# EAGLE board cn7macropad (EAGLE 9.6.2), part 1 of 3
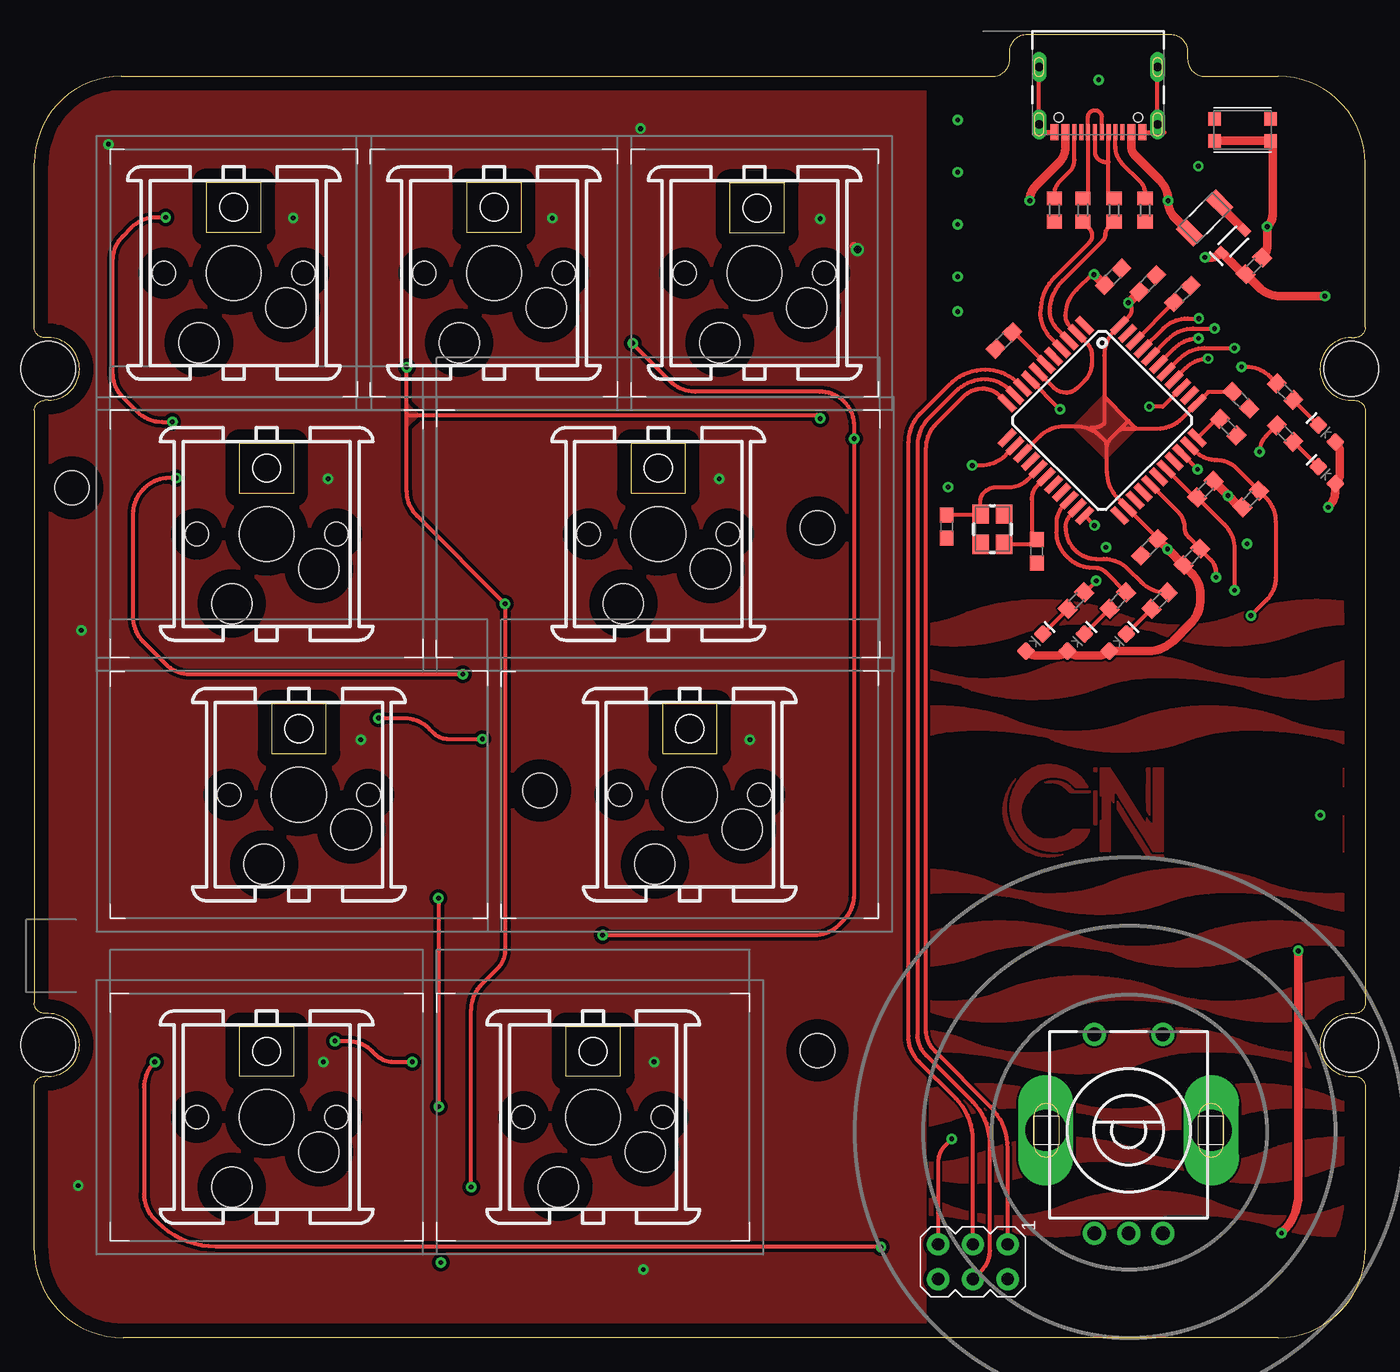
[diagram p3: board, top side]
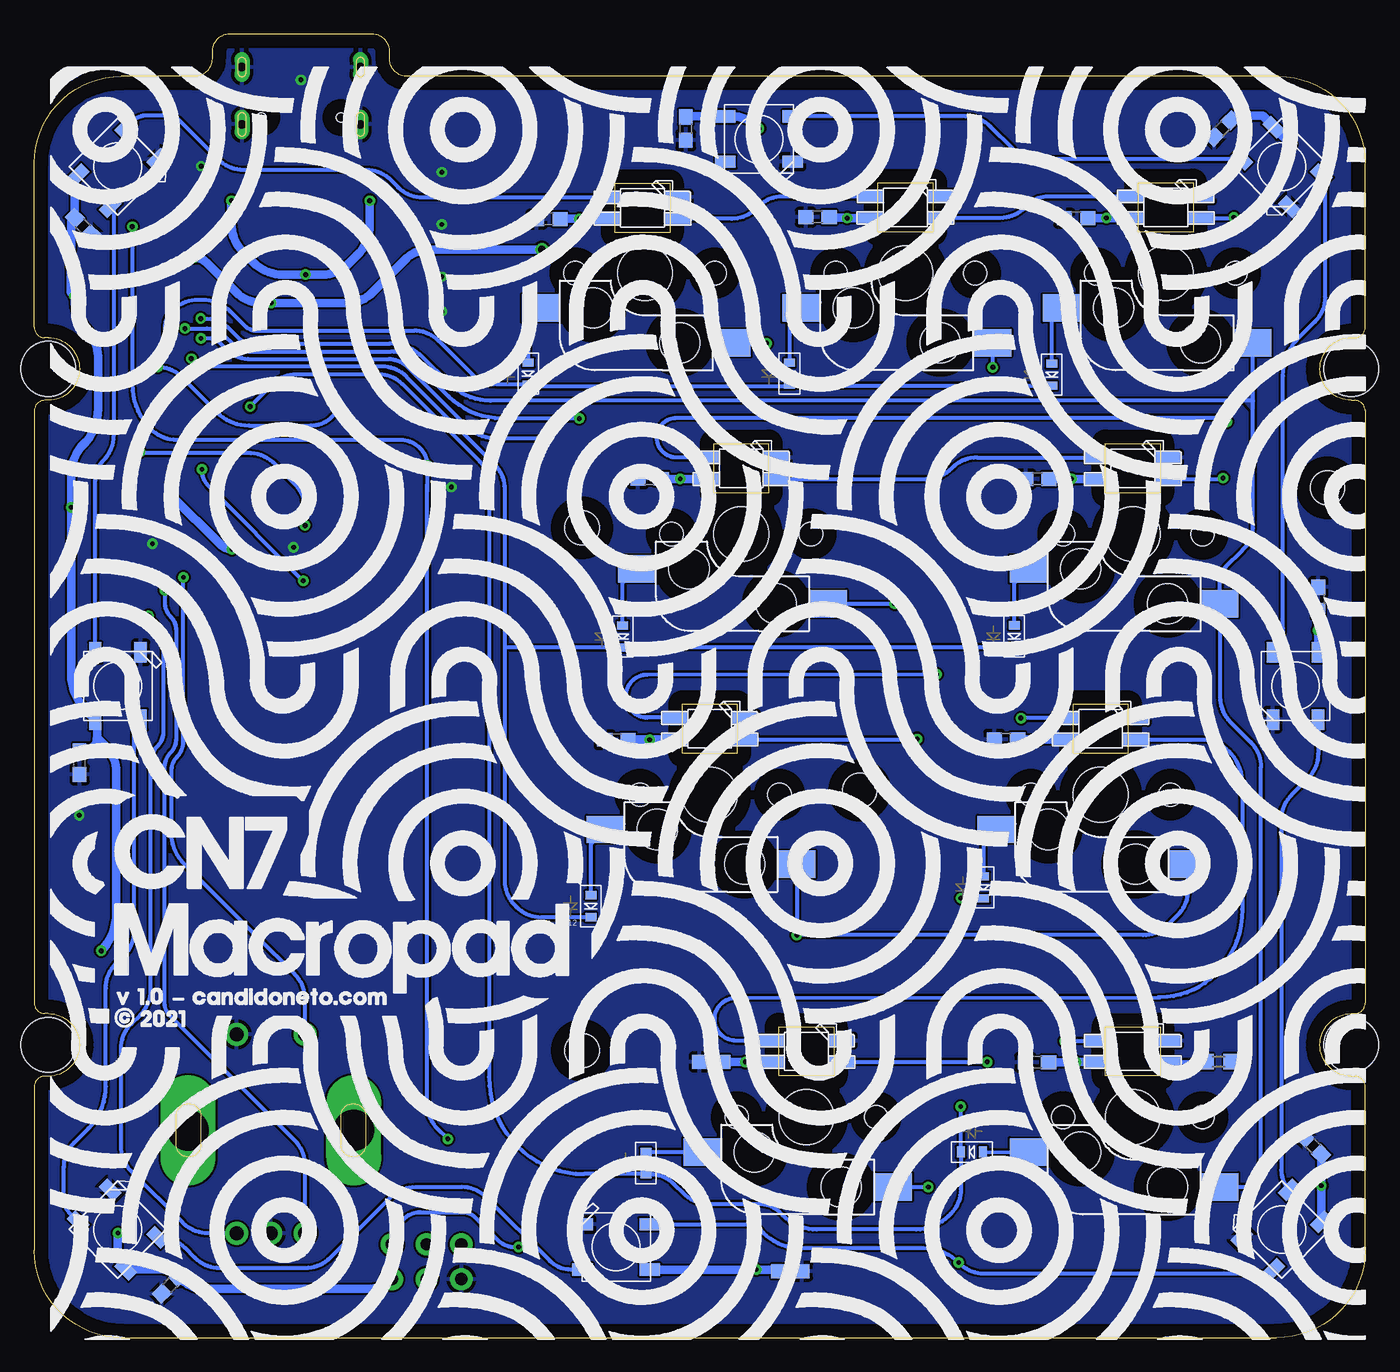
[diagram p4: board, bottom side, seen from below]

Size 97.03 x 95.01 mm. Coordinates in mm from the lower left corner, seen from the top.
Outline: 90.68,0 arc90 97.03,6.35 97.03,18.29 arc90 96.27,19.05 96.01,19.05 arc-90 93.73,21.34 arc-90 96.01,23.62 96.27,23.62 arc90 97.03,24.38 97.03,67.56 arc90 96.27,68.33 96.01,68.33 arc-90 93.73,70.61 arc-90 96.01,72.9 96.27,72.9 arc90 97.03,73.66 97.03,85.6 arc90 90.68,91.95 85.34,91.95 arc-90 84.07,93.22 84.07,93.74 arc90 82.8,95.01 72.39,95.01 arc90 71.12,93.74 71.12,93.22 arc-90 69.85,91.95 6.35,91.95 arc90 0,85.6 0,73.66 arc90 0.76,72.9 1.02,72.9 arc-90 3.3,70.61 arc-90 1.02,68.33 0.76,68.33 arc90 0,67.56 0,24.38 arc90 0.76,23.62 1.02,23.62 arc-90 3.3,21.34 arc-90 1.02,19.05 0.76,19.05 arc90 0,18.29 0,6.35 arc90 6.48,0 90.68,0
Copper layers (1*16): Top 0.035mm / dielectric 1.5mm / Bottom 0.035mm
Design rules "default *": minimum track width 6mil, minimum drill 0.35mm, track to track 6mil, track to pad 6mil, pad to pad 6mil, via to via 6mil, smd to smd 6mil, copper to edge 40mil, drill to drill 6mil, minimum pad ring 10mil, minimum via ring 8mil, stop-mask expansion 4mil, vias tented up to drill 20mil, thermal gap 10mil
Holes 2.5 mm at 36.86,39.88 57.1,59.03 57.1,20.93 2.74,61.95
Holes 4 mm at 1.02,70.61 1.02,21.34 96.01,70.61 96.01,21.34

## Footprints (pad centres in the part's own frame; a part is rotated, then mirrored left to right if it is on the bottom)
0603 = smd 1.1 x 1: 1 -0.85,0; 2 0.85,0
SOD-323 = smd 0.63 x 0.83: A 1.15,0; C -1.15,0
LED-0603 = smd 1 x 1: A -0.877,0; C 0.877,0
SOD-523 = smd 0.8 x 0.6: A 0,-0.8; K 0,0.8
AVRISP = drill 0.9 pad 1.626: 1 -1.27,2.54; 2 1.27,2.54; 3 -1.27,0; 4 1.27,0; 5 -1.27,-2.54; 6 1.27,-2.54
GCT_USB4105_REVA = smd 0.6 x 1.15: A1/B12 -3.2,4.755; A4/B9 -2.4,4.755; B1/A12 3.2,4.755; B4/A9 2.4,4.755 | smd 0.3 x 1.15: A5 -1.25,4.755; A6 -0.25,4.755; A7 0.25,4.755; A8 1.25,4.755; B5 1.75,4.755; B6 0.75,4.755; B7 -0.75,4.755; B8 -1.75,4.755 | drill 0.6 pad 1 long: G1 -4.32,0; G2 4.32,0 | drill 0.6 pad 1.05 long: G3 -4.32,4.18; G4 4.32,4.18 | hole 0.65: 2.89,3.68; -2.89,3.68
SK6812-MINI-E = smd 1.8 x 0.82 bottom: 1-VDD -2.57,0.78; 2-DOUT -2.57,-0.78; 3-GND 2.57,-0.78; 4-DIN 2.57,0.78
WS2812B = smd 1.5 x 0.9: 1-VDD 2.45,-1.65; 2-DOUT 2.45,1.65; 3-GND -2.45,1.65; 4-DIN -2.45,-1.65
R0603 = smd 1 x 1.1: 1 -0.85,0; 2 0.85,0
SW_KMR621NGLFS = smd 0.9 x 1: 1_1 -2.05,0.8; 1_2 2.05,0.8; 2_1 -2.05,-0.8; 2_2 2.05,-0.8
SWITCH_SOCKET-1.25U = smd 2.7 x 2 bottom: 1 6.355,5.08; 2 -7.625,2.54 | hole 4: 0,0 | hole 2.93: -3.81,2.54; 2.54,5.08 | hole 1.7: -5.08,0; 5.08,0
SWITCH_SOCKET-1.5U = smd 2.7 x 2 bottom: 1 6.355,5.08; 2 -7.625,2.54 | hole 4: 0,0 | hole 2.93: -3.81,2.54; 2.54,5.08 | hole 1.7: -5.08,0; 5.08,0
SWITCH_SOCKET-1.75U = smd 2.7 x 2 bottom: 1 6.355,5.08; 2 -7.625,2.54 | hole 4: 0,0 | hole 2.93: -3.81,2.54; 2.54,5.08 | hole 1.7: -5.08,0; 5.08,0
SWITCH_SOCKET-1U = smd 2.7 x 2 bottom: 1 6.355,5.08; 2 -7.625,2.54 | hole 4: 0,0 | hole 2.93: -3.81,2.54; 2.54,5.08 | hole 1.7: -5.08,0; 5.08,0
EC11B-V = drill 1 pad 1.676: A -2.5,-7.5; B 2.5,-7.5; C 0,-7.5; D -2.5,7; E 2.5,7 | drill 3 pad 3.3 long: G1 -6.032,0; G2 6.032,0
TQFP44 = smd 1.5 x 0.5: 1 -5.8,4; 2 -5.8,3.2; 3 -5.8,2.4; 4 -5.8,1.6; 5 -5.8,0.8; 6 -5.8,0; 7 -5.8,-0.8; 8 -5.8,-1.6; 9 -5.8,-2.4; 10 -5.8,-3.2; 11 -5.8,-4; 23 5.8,-4; 24 5.8,-3.2; 25 5.8,-2.4; 26 5.8,-1.6; 27 5.8,-0.8; 28 5.8,0; 29 5.8,0.8; 30 5.8,1.6; 31 5.8,2.4; 32 5.8,3.2; 33 5.8,4 | smd 0.5 x 1.5: 12 -4,-5.8; 13 -3.2,-5.8; 14 -2.4,-5.8; 15 -1.6,-5.8; 16 -0.8,-5.8; 17 0,-5.8; 18 0.8,-5.8; 19 1.6,-5.8; 20 2.4,-5.8; 21 3.2,-5.8; 22 4,-5.8; 34 4,5.8; 35 3.2,5.8; 36 2.4,5.8; 37 1.6,5.8; 38 0.8,5.8; 39 0,5.8; 40 -0.8,5.8; 41 -1.6,5.8; 42 -2.4,5.8; 43 -3.2,5.8; 44 -4,5.8
PTC1206 = smd 1.06 x 1.82: 1 -1.528,0; 2 1.528,0
CRYSTAL-SMD-3.2X2.5MM = smd 1.4 x 1.2: 1 -1.1,-0.85; 2 1.1,-0.85; 3 1.1,0.85; 4 -1.1,0.85

## Placement (x,y rotation side)
C1  10uF  [0603]  87.96,68.33 315 top
C2  1.0uF  [0603]  78.65,77.34 45 top
C3  1.0uF  [0603]  83.7,76.09 45 top
C4  1.0uF  [0603]  70.7,72.69 225 top
C5  1.0uF  [0603]  81.18,76.84 45 top
C6  1.0uF  [0603]  81.29,57.61 225 top
C7  22pF  [0603]  73.09,57.33 90 top
C8  22pF  [0603]  66.52,59.12 90 top
C9  0.1uf  [0603]  93.47,81.03 135 bottom
C10  0.1uf  [0603]  93.73,41.91 90 bottom
C11  0.1uf  [0603]  87.12,3.81 45 bottom
C12  0.1uf  [0603]  3.81,13.97 315 bottom
C13  0.1uf  [0603]  3.43,53.85 270 bottom
C14  0.1uf  [0603]  41.91,4.83 180 bottom
C15  0.1uf  [0603]  10.41,88.14 45 bottom
C16  0.1uf  [0603]  23.93,20.07 0 bottom
C17  0.1uf  [0603]  47.68,20.09 0 bottom
C18  0.1uf  [0603]  26.19,43.61 0 bottom
C19  0.1uf  [0603]  54.58,43.59 0 bottom
C20  0.1uf  [0603]  23.9,62.59 0 bottom
C21  0.1uf  [0603]  52.17,62.61 0 bottom
C22  0.1uf  [0603]  21.08,81.61 0 bottom
C23  0.1uf  [0603]  39.93,81.69 0 bottom
C24  0.1uf  [0603]  59.56,81.53 0 bottom
C25  0.1uf  [0603]  49.53,88.14 90 bottom
D1  3A/10V/280mV  [SOD-323]  87.4,79.91 45 top
D2  [LED-0603]  75.95,50.67 45 top
D3  [LED-0603]  78.99,50.67 45 top
D4  [LED-0603]  94.23,62.86 135 top
D5  [SOD-523]  22.85,70.21 180 bottom
D6  [SOD-523]  25.59,51.13 180 bottom
D7  [SOD-523]  28.68,13.53 90 bottom
D8  [SOD-523]  52.44,12.73 180 bottom
D9  [SOD-523]  54.14,51.1 180 bottom
D10  [SOD-523]  41.97,70.28 180 bottom
D11  [SOD-523]  61.02,70.28 180 bottom
D12  [SOD-523]  56.45,31.45 180 bottom
D13  [SOD-523]  27.83,32.82 180 bottom
D14  [LED-0603]  72.9,50.67 45 top
D15  [LED-0603]  94.23,65.91 135 top
ISP1  AVRISP-6  [AVRISP]  68.43,5.52 270 top
J2  USB4105_REVA  [GCT_USB4105_REVA]  77.57,92.62 180 top
LED_1  [SK6812-MINI-E]  16.94,20.86 180 top
LED_2  [SK6812-MINI-E]  40.74,20.86 180 top
LED_3  [SK6812-MINI-E]  19.29,44.38 180 top
LED_4  [SK6812-MINI-E]  47.79,44.38 180 top
LED_5  [SK6812-MINI-E]  16.94,63.38 180 top
LED_6  [SK6812-MINI-E]  45.49,63.38 180 top
LED_7  [SK6812-MINI-E]  14.54,82.4 180 top
LED_8  [SK6812-MINI-E]  33.51,82.4 180 top
LED_9  [SK6812-MINI-E]  52.7,82.34 180 top
LED_10  WS2812B5050  [WS2812B]  90.93,85.34 225 bottom
LED_11  WS2812B5050  [WS2812B]  90.93,47.5 270 bottom
LED_12  WS2812B5050  [WS2812B]  90.93,7.87 315 bottom
LED_13  WS2812B5050  [WS2812B]  54.61,6.6 0 bottom
LED_14  WS2812B5050  [WS2812B]  6.1,7.87 45 bottom
LED_15  WS2812B5050  [WS2812B]  5.08,47.5 90 bottom
LED_16  WS2812B5050  [WS2812B]  6.1,85.34 135 bottom
LED_17  WS2812B5050  [WS2812B]  44.2,87.38 180 bottom
R1  5.1k  [R0603]  74.37,82.19 270 top
R2  5.1k  [R0603]  80.98,82.19 270 top
R3  22  [R0603]  76.45,82.19 270 top
R4  22  [R0603]  78.72,82.19 270 top
R5  10k  [R0603]  88.92,78.13 45 top
R6  10k  [R0603]  88.68,61.14 225 top
R7  10k  [R0603]  85.38,61.85 45 top
R8  10k  [R0603]  84.39,56.92 225 top
R9  500  [R0603]  10.69,20.12 180 bottom
R10  200  [R0603]  78.99,53.72 225 top
R11  200  [R0603]  82.04,53.72 225 top
R12  200  [R0603]  91.19,65.91 315 top
R13  10k  [R0603]  87.05,66.37 315 top
R14  200  [R0603]  91.19,68.96 315 top
R15  200  [R0603]  75.95,53.72 225 top
S2  KMR621NGLFS  [SW_KMR621NGLFS]  88.09,88.04 0 top
SW1  KAILH1.25U  [SWITCH_SOCKET-1.25U]  16.94,16.06 180 top
SW2  KAILH1.25U  [SWITCH_SOCKET-1.25U]  40.74,16.06 180 top
SW3  KAILH1.5U  [SWITCH_SOCKET-1.5U]  19.29,39.58 180 top
SW4  KAILH1.5U  [SWITCH_SOCKET-1.5U]  47.79,39.58 180 top
SW5  KAILH1.25U  [SWITCH_SOCKET-1.25U]  16.94,58.58 180 top
SW6  KAILH1.75U  [SWITCH_SOCKET-1.75U]  45.49,58.58 180 top
SW7  KAILH  [SWITCH_SOCKET-1U]  14.54,77.6 180 top
SW8  KAILH  [SWITCH_SOCKET-1U]  33.51,77.6 180 top
SW9  KAILH  [SWITCH_SOCKET-1U]  52.51,77.6 180 top
SW10  EC11B-V-T  [EC11B-V]  79.78,15.11 0 top
U1  32U4  [TQFP44]  77.86,66.85 315 top
U$1  PTC-FUSE  [PTC1206]  85.32,81.61 45 top
Y2  [CRYSTAL-SMD-3.2X2.5MM]  69.85,58.93 90 top

## Tracks (layer width: path | path; a pad name or v marks a point on that pad's centre or on a via)
+5V  (via drill 0.35, 0.55)
  Top 0.305: U1.24 79.87,60.49 | 80.28,66.31 79.78,66.82 | 79.78,66.82 78.01,68.59 | C1.1 85.59,68.93 U1.34 83.65,66.99 arc-45 81.85,66.24 79.32,66.24 arc45 79.11,66.15 | 78.12,65.17 78.19,65.23 | 78.19,65.23 78.39,65.43 | 78.39,65.43 79.11,66.15 | 79.11,66.15 79.78,66.82 | 79.78,66.82 | 77.72,65.7 77.08,66.34 77.3,66.34 arc45 77.98,66.62 arc45 78,66.69 78,71.61 arc-45 78.75,73.4 U1.44 | 87.81,60.43 R6.2 | C6.1 81.89,58.29 U1.24 | U1.24 79.02,61.17 arc-45 78.21,63.12 78.21,65 arc-45 78.39,65.43 | U1.14 73.31,65.7 arc-45 75.11,66.45 75.92,66.45 arc-45 77.72,65.7 | 77.72,65.7 78.19,65.23 | U1.44 79.33,73.98 | U1.44 79.45,74.11 | U1.44 79.82,74.48 arc45 80.01,74.93 arc45 79.8,75.44 79.79,75.45
  Top 0.61: C6.1 81.89,58.11 81.99,58.11 v82.62,57.48 83.78,56.32 arc45 R8.2 84.36,55.75 arc-45 85.01,54.18 85.01,53.83 arc-45 84.27,52.04 83.03,50.8 arc-45 81.23,50.05 D3.A arc-45 77.54,49.71 76.16,49.71 arc-45 D2.A arc-45 74.55,49.73 73.05,49.73 arc-45 D14.A | v60.02,79.32 59.77,79.58 | R7.2 87.01,61.42 arc-45 v87.03,61.38 87.72,60.69 arc45 R6.2 | v92.15,28.19 92.15,10.43 arc-45 91.03,7.71 v90.93,7.62 | v94.08,75.92 90.85,75.92 arc-45 89.27,76.58 R5.1 arc-45 88.04,77.64 D1.C arc-45 85.73,78.74 v85.34,78.74 | C5.1 79.79,75.45 arc-45 v79.76,75.44 | v94.34,60.53 arc45 94.85,61.78 D4.A arc45 95.17,63.02 95.17,64.52 arc45 D15.A
  Bottom 0.61: v5.41,87 LED_16.1-VDD 7.48,89.06 9.49,89.06 C15.2 | LED_10.1-VDD 94.09,84.52 C9.2 94.35,81.35 94.37,77.09 94.36,77.09 94.36,76.2 v94.08,75.92 94.08,75.65 arc-45 93.22,73.56 arc45 92.38,71.54 92.38,67.68 arc45 93.45,65.1 arc-45 94.34,62.95 v94.34,60.53 94.34,48.39 arc-45 93.21,45.68 LED_11.1-VDD 92.46,44.92 92.46,43.7 | LED_13.1-VDD v44.4,4.95 42.91,4.95 arc45 42.87,4.94 C14.2 | v3.2,11.07 LED_14.1-VDD | LED_14.1-VDD 3.05,8.59 | 2.94,8.7 LED_14.1-VDD | LED_15.1-VDD v3.43,51.56 C13.2 | 47.01,89.03 LED_17.1-VDD | 93.61,42.67 C10.2 93.38,42.76 arc-45 92.73,43.03 arc-45 92.46,43.7 | LED_9.1-VDD 57.27,81.56 v57.3,81.56 58.69,81.56 C24.2 | LED_7.1-VDD v18.87,81.62 C22.2 | C23.2 39.03,81.64 37.8,81.64 v37.77,81.61 37.76,81.62 LED_8.1-VDD | LED_5.1-VDD 21.4,62.6 | 21.4,62.6 v21.41,62.61 | C20.2 21.41,62.59 21.4,62.6 | LED_6.1-VDD 49.92,62.6 | 49.92,62.6 v49.94,62.61 | C21.2 51.31,62.6 49.92,62.6 | LED_3.1-VDD 23.79,43.6 | 23.79,43.6 v23.8,43.59 | C18.2 25.33,43.6 23.79,43.6 | LED_4.1-VDD 52.16,43.6 v52.17,43.59 C19.2 | LED_1.1-VDD v21.07,20.08 | v21.07,20.08 v21.08,20.09 | C16.2 21.09,20.07 v21.07,20.08 | LED_2.1-VDD v45.18,20.08 | v45.18,20.08 v45.19,20.09 | C17.2 v45.18,20.08 | v60.02,79.32 68.21,79.32 arc-45 70.01,78.58 72.43,76.16 arc45 74.23,75.41 79.69,75.41 arc45 v79.76,75.44 80.48,75.44 arc45 82.28,76.18 | v82.62,57.48 arc45 83.49,57.84 v87.03,61.38 | 71.12,4.1 ISP1.2 arc45 72.65,3.56 84.61,3.56 arc45 86.41,4.3 C11.2 arc-45 87.88,4.98 LED_12.1-VDD | LED_12.1-VDD 90.12,4.73 | LED_12.1-VDD arc45 90.93,6.34 v90.93,7.62 | v44.2,88.14 44.34,88.28 arc-45 46.14,89.03 LED_17.1-VDD | LED_17.1-VDD 49.44,89.03 arc-45 C25.2
  Bottom 0.61: 92.46,43.7 91.8,43.05 arc45 91.06,41.25 91.06,30.85 arc45 92.15,28.21 v92.15,28.19 | LED_14.1-VDD 3.2,13.34 arc-45 C12.2 | v85.34,78.74 arc45 84.48,78.38 82.28,76.18 | 82.25,76.16 82.28,76.18
  pour Top (isolate 0.254, rank 2): -4.2,94.77 -4.2,0.1 64.94,0.1 64.94,94.77
  pour Top: 75.82,66.42 78.11,64.14 80.26,66.29 77.98,68.58
AREF
  Top 0.305: U1.42 C3.1 arc45 C3.1
CC1
  Top 0.305: R2.1 80.98,83.43 arc45 80.64,84.26 79.34,85.56 arc-45 78.82,86.82 78.82,87.86 arc-45 J2.A5
CC2
  Top 0.305: R1.1 74.37,83.35 arc-45 74.76,84.29 75.47,85 arc45 75.83,85.85 J2.B5
COL0  (via drill 0.35)
  Top 0.305: v84.9,74.29 84.07,74.29 arc45 82.3,73.56 U1.41
  Bottom 0.305: 8.19,68.3 63.79,68.3 arc45 66.76,69.53 68.7,71.47 arc-45 71.1,72.47 81.13,72.47 arc45 82.17,72.9 82.81,73.54 arc-45 84.63,74.29 v84.9,74.29 | 8.19,68.3 8.19,59.21 arc45 8.93,57.42 10.19,56.16 arc-45 10.59,55.19 SW5.1 10.59,46.69 arc-45 9.84,44.89 8.34,43.39 arc45 7.59,41.59 7.59,12.07 arc45 7.92,11.28 8.01,11.2 arc45 8.53,10.98 arc-45 8.54,10.98 SW1.1 | 8.19,68.3 SW7.1
  pour Bottom: 8.18,67.69 8.79,68.3 8.18,68.91
COL1  (via drill 0.35)
  Top 0.305: v86.04,73.56 84.48,73.56 arc45 82.69,72.81 U1.40 | v31.85,10.97 31.85,23.94 arc-45 32.6,25.74 33.78,26.92 arc45 34.31,28.21 v34.31,53.49 27.9,59.91 arc-45 27.15,61.71 27.15,67.26 | 27.15,67.26 v27.15,70.74 | 27.15,67.26 57.05,67.26 v57.3,67.01
  Bottom 0.305: SW2.1 31.86,10.98 v31.85,10.97 | v34.31,53.49 39.13,53.49 SW6.1 | v27.15,70.74 SW8.1 | 57.35,67.05 v57.3,67.01 62.93,67.01 arc45 66.81,68.61 69.42,71.23 arc-45 71,71.88 81.17,71.88 arc45 82.61,72.48 83.15,73.02 arc-45 84.45,73.56 v86.04,73.56
  pour Top: 27.15,68.02 27.93,67.25 27.15,66.47
COL2  (via drill 0.35)
  Top 0.305: U1.39 83.12,72.12 arc-45 v84.87,72.85 | v43.64,72.49 arc45 43.67,72.41 46.37,69.7 arc45 48.17,68.96 57.28,68.96 arc-45 59.05,68.22 arc-45 59.78,66.48 v59.78,65.53 59.78,32.26 arc-45 59.03,30.46 58.66,30.08 arc-45 56.86,29.34 v41.43,29.34
  Bottom 0.305: SW4.1 v41.43,29.34 16.19,29.34 arc-45 14.39,30.08 13.68,30.8 arc-45 12.93,32.59 SW3.1 | SW9.1 46.12,72.49 v43.64,72.49 | v84.87,72.85 84.27,72.85 arc45 83.5,72.53 83.04,72.07 arc-45 81.24,71.32 71.21,71.32 arc45 69.8,70.74 65.5,66.44 arc-45 63.31,65.53 v59.78,65.53
D+
  Top 0.305: R3.1 76.72,83.32 76.82,83.34 J2.B6 76.82,88.98 arc-180 77.82,88.98 77.82,88.47 | 77.82,88.47 J2.A6 | 77.82,88.47 77.83,88.47
D-
  Top 0.305: R4.1 78.31,82.89 78.31,85.7 | J2.B7 78.31,87.86 78.31,85.7 | J2.A7 77.32,86.44 arc45 77.52,85.95 arc45 78.13,85.7 78.31,85.7
D_N
  Top 0.305: U1.3 74.57,73.53 arc-45 74.05,74.8 arc-45 74.98,77.07 77.89,79.98 arc45 78.08,80.43 78.08,80.44 arc-45 78.27,80.89 R4.2
D_P
  Top 0.305: 74.85,72.09 U1.4 74.19,72.79 arc-45 73.35,74.8 arc-45 74.4,77.32 76.91,79.83 arc45 77.11,80.32 arc45 76.86,80.93 R3.2
GND  (via drill 0.35)
  Top 0.305: J2.G3 81.89,91.72 | J2.G4 73.25,91.59 | J2.B1/A12 73.43,87.87 arc-45 73.23,88.37 | J2.A1/B12 82.37,87.87 arc45 82.4,87.86
  other vias: 88.42,57.86 67.31,74.8 84.86,85.39 66.62,62 77.6,91.69 93.75,38.07 78.13,57.61 67.31,77.34 67.31,81.15 67.31,84.96 67.31,88.77
  pour Top (rank 4): 65.14,52.07 98.29,52.07 98.29,95.15 65.14,95.15
  pour Bottom (rank 2): -2.93,96.32 -2.93,-1.35 98.92,-1.35 98.92,96.32
  pour Top (rank 4): 65.41,0.13 95.58,0.13 95.58,3.89 66.67,3.56 66.67,4.7 arc90 66.55,4.83 65.41,4.83
GND1
  pour Top (rank 3): 95.44,52 95.47,52 95.44,53.68 95.44,53.68
  pour Top (rank 3): 95.44,46.68 95.47,46.69 95.48,46.69 95.48,49.36 95.47,49.36 95.44,49.35
  pour Top (rank 3): 95.48,43.26 95.48,44.19 95.48,44.2 95.45,44.2 95.44,44.19 95.44,43.28 95.45,43.27
  pour Top (rank 3): 95.44,31.07 95.47,31.07 95.48,31.07 95.48,32.39 95.45,32.39 95.44,32.38
  pour Top (rank 3): 95.44,28.53 95.47,28.52 95.48,28.53 95.48,29.6 95.48,29.61 95.45,29.62 95.44,29.62
  pour Top (rank 3): 95.44,23.91 95.47,23.92 95.48,23.93 95.48,26.31 95.48,26.31 95.44,26.31 95.44,26.3
  pour Top (rank 3): 95.44,19.28 95.47,19.27 95.48,19.28 95.48,20.99 95.47,21 95.44,20.99 95.44,20.98
  pour Top (rank 3): 95.48,16.5 95.48,17.2 95.45,17.21 95.44,17.21 95.44,16.51 95.45,16.5
  pour Top (rank 3): 95.44,14.61 95.44,12.58 95.45,12.58 95.48,12.58 95.48,12.59 95.48,14.61 95.48,14.62 95.44,14.61
  pour Top (rank 3): 95.44,38.06 95.44,35.37 95.44,35.36 95.48,35.37 95.48,35.38 95.48,38.06 95.45,38.06
  pour Top (rank 3): 95.44,40.14 95.47,40.14 95.48,40.14 95.48,41.51 95.45,41.52 95.44,41.51
  pour Top (rank 3): 94.27,52 94.27,51.88 94.28,51.88 94.55,51.92 94.83,51.95 95.09,51.97 95.43,52 95.44,52
  pour Top (rank 3): 76.69,52.03 76.69,53.49 76.69,53.5 76.4,53.55 76.09,53.6 75.75,53.65 75.53,53.67 75.52,53.67 75.52,52.01 75.84,52.02 76.11,52.03 76.39,52.03
  pour Top (rank 3): 94.27,52 95.44,52 95.44,53.67 95.44,53.68 95.15,53.71 94.87,53.73 94.57,53.75 94.27,53.77
  pour Top (rank 3): 93.1,51.65 93.38,51.72 93.66,51.78 93.95,51.83 94.27,51.88 94.27,52 94.26,52 93.1,52 93.1,52
  pour Top (rank 3): 69.66,50.66 69.66,52 69.66,52 68.49,52 68.49,51.99 68.49,50.5 68.56,50.51 68.75,50.53 69.07,50.57 69.37,50.61
  pour Top (rank 3): 83.72,51.93 83.45,51.93 83.16,51.93 82.89,51.94 82.56,51.96 82.55,51.96 82.55,51.1 82.56,51.09 82.69,51.05 82.83,51.01 82.98,50.96 83.14,50.92 83.32,50.87 83.51,50.82 83.72,50.78 83.72,50.78
  pour Top (rank 3): 91.93,52 91.93,51.29 91.93,51.28 92.22,51.39 92.35,51.44 92.5,51.48 92.74,51.56 92.92,51.61 93.09,51.65 93.1,51.66 93.1,52 93.09,52
  pour Top (rank 3): 70.83,50.93 70.83,52 70.83,52 69.67,52 69.66,51.99 69.66,50.66 69.73,50.67 69.93,50.71 70.24,50.78 70.54,50.85
  pour Top (rank 3): 93.1,52 93.1,53.78 92.79,53.77 92.49,53.76 92.18,53.74 91.93,53.72 91.93,52 91.93,52
  pour Top (rank 3): 68.49,52 67.33,52 67.32,52 67.32,50.43 67.59,50.44 67.9,50.45 68.19,50.47 68.49,50.5 68.49,50.51
  pour Top (rank 3): 79.04,52 79.04,52.81 78.7,52.95 78.59,53 78.47,53.04 78.33,53.09 78.18,53.14 78.03,53.19 77.87,53.24 77.86,53.23 77.86,52
  pour Top (rank 3): 77.69,52 77.86,52 77.86,52.01 77.86,53.23 77.86,53.24 77.64,53.3 77.47,53.34 77.31,53.38 76.97,53.45 76.77,53.49 76.7,53.5 76.69,53.5 76.69,52.04 76.7,52.03 76.94,52.03 77.19,52.02 77.44,52.01
  pour Top (rank 3): 94.27,52 94.27,53.77 93.95,53.78 93.65,53.79 93.32,53.79 93.11,53.78 93.1,53.78 93.1,52
  pour Top (rank 3): 74.35,52 74.35,53.76 74.34,53.77 74.17,53.77 73.81,53.78 73.5,53.79 73.18,53.79 73.18,52 73.18,52
  pour Top (rank 3): 73.18,52 73.18,53.78 73.17,53.79 72.96,53.78 72.62,53.77 72.31,53.75 72.01,53.73 72,52 72.01,52
  pour Top (rank 3): 75.45,52 74.35,52 74.35,51.99 74.35,51.9 74.36,51.9 74.63,51.93 74.92,51.96 75.17,51.98
  pour Top (rank 3): 81.38,51.54 81.38,51.99 81.38,52 80.21,52 80.21,52 80.21,51.74 80.21,51.74 80.51,51.69 80.79,51.64 81.09,51.59
  pour Top (rank 3): 69.66,52 69.66,53.37 69.66,53.37 69.35,53.29 69.05,53.21 68.73,53.12 68.53,53.05 68.5,53.04 68.49,53.04 68.49,52 68.5,52
  pour Top (rank 3): 68.49,52 68.49,53.04 68.48,53.04 68.33,52.98 68.04,52.88 67.83,52.8 67.52,52.67 67.32,52.59 67.32,52
  pour Top (rank 3): 74.35,51.9 74.35,52 73.18,52 73.18,51.68 73.49,51.75 73.76,51.8 74.05,51.85
  pour Top (rank 3): 80.21,51.74 80.21,51.99 80.2,52 79.04,52 79.04,52 79.04,51.89 79.34,51.86 79.63,51.82 79.92,51.78
  pour Top (rank 3): 72,52 72,53.73 71.94,53.73 71.73,53.71 71.38,53.67 71.19,53.65 71,53.62 70.84,53.6 70.83,53.59 70.83,52 70.84,52
  pour Top (rank 3): 79.04,51.89 79.04,52 79.03,52 77.86,52 77.86,51.99 78.15,51.97 78.44,51.95 78.74,51.92
  pour Top (rank 3): 75.45,52 75.51,52 75.52,52.01 75.52,53.67 75.23,53.7 74.95,53.73 74.65,53.75 74.35,53.77 74.35,53.76 74.35,52.01 74.35,52
  pour Top (rank 3): 71.97,51.31 72,51.32 72,51.33 72,52 72,52 70.83,52 70.83,50.94 70.84,50.93 71.12,51.02 71.41,51.11 71.69,51.2
  pour Top (rank 3): 73.18,51.68 73.18,52 73.17,52 72.01,52 72,51.99 72.01,51.32 72.15,51.37 72.29,51.42 72.43,51.47 72.57,51.52 72.71,51.56 72.87,51.6 73.02,51.64
  pour Top (rank 3): 77.86,52 77.69,52 77.86,51.99
  pour Top (rank 3): 66.15,52 64.98,52 64.97,52 64.97,50.56 64.98,50.56 65.18,50.53 65.37,50.51 65.56,50.49 65.77,50.48 65.96,50.46 66.14,50.45 66.15,50.45
  pour Top (rank 3): 67.32,52.59 67.18,52.54 67.04,52.49 66.89,52.44 66.74,52.39 66.6,52.35 66.45,52.31 66.31,52.27 66.15,52.23 66.15,52.23 66.15,52.01 66.15,52 67.32,52
  pour Top (rank 3): 70.83,52 70.83,53.59 70.83,53.6 70.53,53.55 70.24,53.5 69.95,53.44 69.67,53.37 69.66,53.37 69.66,52 69.67,52
  pour Top (rank 3): 81.38,52 81.38,52.13 81.37,52.13 81.04,52.2 80.77,52.26 80.48,52.33 80.21,52.41 80.21,52 80.22,52
  pour Top (rank 3): 67.32,50.43 67.32,52 67.31,52 66.15,52 66.15,50.45 66.15,50.45 66.38,50.44 66.71,50.43 67.02,50.43
  pour Top (rank 3): 66.15,52.23 65.86,52.17 65.57,52.11 65.28,52.06 64.98,52.02 64.97,52.02 64.97,52.01 64.98,52 66.14,52 66.15,52.01
  pour Top (rank 3): 80.21,52 80.21,52.41 79.9,52.5 79.75,52.55 79.6,52.6 79.32,52.7 79.18,52.75 79.04,52.81 79.04,52.8 79.04,52 79.04,52
  pour Top (rank 3): 83.72,50.77 84.05,50.71 84.37,50.65 84.58,50.62 84.79,50.58 84.89,50.57 84.9,50.58 84.9,52 84.89,52 84.8,52 84.54,51.98 84.26,51.95 84,51.94 83.73,51.93 83.72,51.93
  pour Top (rank 3): 88.41,52 88.41,53 88.2,52.93 88,52.85 87.83,52.79 87.55,52.67 87.4,52.61 87.25,52.55 87.24,52.55 87.24,52 87.25,52
  pour Top (rank 3): 90.75,50.9 90.75,52 89.58,52 89.58,50.65 89.59,50.64 89.77,50.68 89.95,50.71 90.13,50.75 90.44,50.82
  pour Top (rank 3): 89.58,52 89.58,53.34 89.58,53.35 89.36,53.29 89.18,53.24 89.01,53.19 88.69,53.1 88.53,53.04 88.41,53 88.41,52
  pour Top (rank 3): 89.58,50.64 89.58,52 89.58,52 88.41,52 88.41,51.99 88.41,50.49 88.48,50.5 88.67,50.52 88.99,50.55 89.29,50.6
  pour Top (rank 3): 86.07,52 84.9,52 84.9,52 84.9,50.57 85.19,50.53 85.48,50.5 85.77,50.48 86.06,50.46 86.07,50.46
  pour Top (rank 3): 84.9,52.01 84.81,52 84.89,52
  pour Top (rank 3): 91.93,51.28 91.93,52 91.92,52 90.76,52 90.75,51.99 90.75,50.91 90.76,50.9 90.95,50.96 91.12,51.01 91.3,51.06 91.46,51.12 91.62,51.17 91.77,51.22
  pour Top (rank 3): 87.24,50.43 87.24,52 87.23,52 86.07,52 86.07,51.99 86.07,50.46 86.33,50.44 86.64,50.43 86.94,50.43
  pour Top (rank 3): 86.07,52 86.07,52.2 86.06,52.21 85.82,52.16 85.57,52.11 85.4,52.08 85.23,52.05 85.07,52.03 84.9,52.01 84.9,52
  pour Top (rank 3): 87.24,52 87.24,52.55 87.23,52.55 86.96,52.45 86.82,52.41 86.67,52.37 86.41,52.29 86.24,52.25 86.08,52.21 86.07,52.21 86.07,52 86.07,52
  pour Top (rank 3): 88.41,50.49 88.41,51.99 88.41,52 87.25,52 87.24,52 87.24,50.43 87.53,50.44 87.83,50.45 88.11,50.47
  pour Top (rank 3): 81.38,51.54 81.64,51.48 81.65,51.48 81.77,51.43 81.88,51.39 81.97,51.34 82.12,51.27 82.23,51.22 82.41,51.15 82.54,51.1 82.55,51.1 82.55,51.95 82.55,51.96 82.5,51.96 82.45,51.97 82.16,52 81.38,52 81.38,52
  pour Top (rank 3): 91.93,52 91.93,53.72 91.92,53.72 91.8,53.71 91.6,53.69 91.4,53.67 91.08,53.63 90.76,53.58 90.75,52 90.76,52
  pour Top (rank 3): 82.17,52 81.98,52.03 81.79,52.06 81.6,52.09 81.38,52.13 81.38,52
  pour Top (rank 3): 90.75,52 90.75,53.58 90.47,53.53 90.17,53.48 89.87,53.41 89.58,53.35 89.58,52 89.59,52
  pour Top (rank 3): 77.78,47.4 77.86,47.43 77.86,48.43 77.85,48.43 76.69,48.43 76.69,47.04 76.97,47.12 77.24,47.21 77.51,47.3
  pour Top (rank 3): 80.21,48 80.21,48.42 80.2,48.43 79.04,48.43 79.04,48.42 79.04,47.79 79.04,47.79 79.34,47.85 79.65,47.91 79.92,47.96
  pour Top (rank 3): 79.04,47.79 79.04,48.43 79.03,48.43 77.86,48.43 77.86,47.44 77.87,47.44 78.02,47.49 78.18,47.55 78.45,47.63 78.59,47.67 78.74,47.71 78.88,47.75
  pour Top (rank 3): 66.15,48.46 66.15,48.43 66.15,48.43 66.27,48.43
  pour Top (rank 3): 82.55,48.13 82.55,48.43 82.54,48.43 81.39,48.43 81.38,48.43 81.38,48.11 81.39,48.1 81.68,48.12 81.96,48.12 82.25,48.13
  pour Top (rank 3): 76.69,47.04 76.69,48.43 76.68,48.43 75.52,48.43 75.52,48.42 75.52,46.77 75.61,46.78 75.79,46.82 76.1,46.89 76.39,46.96
  pour Top (rank 3): 95.16,46.64 94.27,46.64 94.27,46.63 94.27,46.56 94.28,46.56 94.35,46.56 94.67,46.59 94.92,46.61
  pour Top (rank 3): 88.41,47.33 88.53,47.29 88.66,47.24 88.8,47.18 88.95,47.13 89.12,47.08 89.31,47.03 89.58,46.96 89.58,46.96 89.58,48.03 89.29,48.03 89.01,48.04 88.71,48.06 88.41,48.08
  pour Top (rank 3): 86.07,47.83 86.07,48.42 86.06,48.43 84.9,48.43 84.9,48.42 84.9,47.98 84.9,47.98 85.25,47.94 85.51,47.91 85.79,47.87
  pour Top (rank 3): 81.38,48.1 81.38,48.42 81.37,48.43 80.21,48.43 80.21,48.42 80.21,48 80.21,48 80.5,48.03 80.78,48.06 81.08,48.09
  pour Top (rank 3): 84.9,47.98 84.9,48.42 84.89,48.43 83.73,48.43 83.72,48.42 83.72,48.09 83.73,48.08 84.01,48.06 84.3,48.04 84.6,48.01
  pour Top (rank 3): 73.18,46.53 73.18,46.63 73.17,46.64 72.01,46.64 72,46.64 72.01,46.54 72.29,46.53 72.59,46.53 72.88,46.52
  pour Top (rank 3): 70.83,48.12 70.55,48.09 70.26,48.07 69.96,48.05 69.66,48.03 69.66,48.02 69.66,46.84 69.76,46.82 69.95,46.78 70.3,46.72 70.52,46.69 70.73,46.66 70.83,46.65 70.83,46.65
  pour Top (rank 3): 80.21,48.43 80.21,49.86 79.94,49.87 79.62,49.88 79.31,49.88 79.04,49.88 79.04,48.43 79.04,48.43
  pour Top (rank 3): 72,46.64 72,48.34 71.71,48.27 71.45,48.22 71.19,48.18 71.01,48.15 70.84,48.13 70.83,48.12 70.83,46.65 70.84,46.65 70.88,46.64
  pour Top (rank 3): 74.35,46.6 74.35,46.64 73.18,46.64 73.18,46.54 73.18,46.53 73.41,46.53 73.66,46.55 74.01,46.57
  pour Top (rank 3): 84.9,48.43 84.9,48.89 84.89,48.89 84.75,48.95 84.53,49.04 84.42,49.09 84.3,49.14 84.14,49.19 83.95,49.25 83.73,49.32 83.72,49.31 83.72,48.43
  pour Top (rank 3): 74.72,46.64 74.35,46.64 74.35,46.64 74.35,46.6 74.35,46.6 74.38,46.6
  pour Top (rank 3): 66.15,48.43 64.98,48.43 64.97,48.43 64.97,47.98 64.98,47.97 65.27,47.93 65.56,47.9 65.85,47.86 66.14,47.81 66.15,47.82
  pour Top (rank 3): 86.07,48.43 86.07,48.48 86.07,48.49 85.76,48.58 85.46,48.68 85.18,48.78 84.9,48.89 84.9,48.43 84.9,48.43
  pour Top (rank 3): 74.72,46.64 74.97,46.67 75.21,46.71 75.51,46.77 75.52,46.77 75.52,48.42 75.51,48.43 74.35,48.43 74.35,48.42 74.35,46.65 74.35,46.64
  pour Top (rank 3): 66.15,48.46 65.85,48.55 65.56,48.64 65.31,48.72 65.14,48.78 64.98,48.84 64.97,48.84 64.97,48.43 66.14,48.43 66.15,48.43
  pour Top (rank 3): 74.35,48.43 73.18,48.43 73.18,46.65 73.18,46.64 74.34,46.64 74.35,46.65
  pour Top (rank 3): 72,46.64 73.17,46.64 73.18,46.64 73.18,48.43 73.17,48.43 72.34,48.43 72.19,48.39 72,48.34
  pour Top (rank 3): 79.04,48.43 79.04,49.88 79.03,49.88 78.91,49.88 78.71,49.88 78.51,49.87 78.19,49.85 77.87,49.83 77.86,49.83 77.86,48.43
  pour Top (rank 3): 86.3,48.43 86.07,48.49 86.07,48.48 86.07,48.43 86.07,48.43
  pour Top (rank 3): 86.07,47.83 86.36,47.78 86.65,47.73 86.94,47.68 87.23,47.62 87.24,47.63 87.24,48.23 87.02,48.27 86.83,48.3 86.57,48.36 86.3,48.43 86.08,48.43 86.07,48.43
  pour Top (rank 3): 83.72,48.08 83.72,48.43 83.72,48.43 82.55,48.43 82.55,48.13 82.56,48.13 82.9,48.12 83.16,48.11 83.44,48.1
  pour Top (rank 3): 75.52,48.43 75.52,49.47 75.51,49.48 75.32,49.43 75.12,49.38 74.93,49.33 74.73,49.27 74.55,49.21 74.35,49.15 74.35,49.14 74.35,48.43 74.36,48.43
  pour Top (rank 3): 90.75,46.72 91.03,46.68 91.31,46.64 91.92,46.64 91.93,46.65 91.93,48.23 91.92,48.23 91.62,48.17 91.31,48.13 91.03,48.1 90.76,48.07 90.75,48.06
  pour Top (rank 3): 93.1,48.52 93.1,48.44 93.1,48.43 94.27,48.43 94.27,48.96 94.26,48.96 94.15,48.92 93.79,48.77 93.58,48.69 93.34,48.6
  pour Top (rank 3): 67.32,48.2 67.04,48.25 66.78,48.31 66.53,48.36 66.27,48.43 66.15,48.43 66.15,47.82 66.15,47.81 66.44,47.76 66.74,47.71 67.02,47.66 67.31,47.6 67.32,47.61
  pour Top (rank 3): 93.1,46.64 94.27,46.64 94.27,48.42 94.26,48.43 93.1,48.43 93.1,48.42
  pour Top (rank 3): 91.93,48.23 91.93,46.65 91.93,46.64 93.09,46.64 93.1,46.65 93.1,48.43 92.78,48.43 92.56,48.37 92.35,48.32 92.14,48.27
  pour Top (rank 3): 93.1,48.43 93.1,48.52 92.93,48.47 92.78,48.43
  pour Top (rank 3): 91.93,46.58 91.93,46.63 91.93,46.64 91.32,46.64 91.61,46.61
  pour Top (rank 3): 77.86,48.43 77.86,49.83 77.86,49.83 77.75,49.82 77.54,49.8 77.34,49.78 77.01,49.74 76.69,49.7 76.69,48.43 76.7,48.43
  pour Top (rank 3): 76.69,48.43 76.69,49.7 76.68,49.7 76.64,49.69 76.43,49.66 76.1,49.6 75.78,49.54 75.58,49.49 75.53,49.48 75.52,49.48 75.52,48.43 75.53,48.43
  pour Top (rank 3): 94.27,48.43 95.43,48.43 95.44,48.43 95.44,49.35 95.33,49.32 95.16,49.27 94.85,49.17 94.56,49.07 94.28,48.97 94.27,48.96
  pour Top (rank 3): 94.27,48.43 94.27,46.65 94.28,46.64 95.15,46.64 95.25,46.65 95.44,46.68 95.44,46.69 95.44,48.43 95.43,48.43
  pour Top (rank 3): 89.58,48.03 89.58,46.96 89.59,46.95 89.79,46.91 90.12,46.83 90.43,46.77 90.75,46.72 90.75,46.73 90.75,48.07 90.47,48.05 90.18,48.03 89.88,48.03
  pour Top (rank 3): 81.38,48.43 81.38,49.76 81.11,49.79 80.81,49.82 80.51,49.84 80.21,49.86 80.21,49.85 80.21,48.43 80.22,48.43
  pour Top (rank 3): 67.83,47.4 67.9,47.37 67.96,47.34 68.13,47.27 68.24,47.23 68.35,47.19 68.48,47.14 68.49,47.15 68.49,48.04 68.48,48.05 68.28,48.06 67.96,48.1 67.65,48.14 67.32,48.2 67.32,48.19 67.32,47.61 67.32,47.6 67.43,47.58 67.49,47.56 67.58,47.52 67.67,47.48 67.75,47.44
  pour Top (rank 3): 91.93,46.58 92.21,46.56 92.51,46.54 92.8,46.53 93.1,46.52 93.1,46.53 93.1,46.64 93.09,46.64 91.93,46.64 91.93,46.63
  pour Top (rank 3): 70.88,46.64 71.22,46.6 71.57,46.57 71.78,46.56 72,46.54 72,46.55 72,46.64 72,46.64
  pour Top (rank 3): 93.1,46.52 93.4,46.52 93.69,46.53 93.98,46.54 94.27,46.56 94.27,46.64 93.1,46.64
  pour Top (rank 3): 82.55,48.43 82.55,49.58 82.55,49.59 82.27,49.64 81.97,49.69 81.67,49.73 81.38,49.76 81.38,48.43 81.39,48.43
  pour Top (rank 3): 88.41,47.33 88.41,48.08 88.13,48.11 87.86,48.14 87.55,48.18 87.25,48.23 87.24,48.23 87.24,47.63 87.24,47.62 87.52,47.57 87.78,47.51 88.03,47.46 88.28,47.4
  pour Top (rank 3): 73.18,48.43 73.18,48.69 73.17,48.7 72.97,48.63 72.77,48.56 72.57,48.49 72.35,48.43
  pour Top (rank 3): 74.35,48.43 74.35,49.14 74.35,49.15 74.06,49.05 73.79,48.95 73.63,48.88 73.35,48.77 73.18,48.7 73.18,48.7 73.18,48.43
  pour Top (rank 3): 83.72,48.43 83.72,49.31 83.72,49.32 83.45,49.39 83.16,49.46 82.87,49.53 82.55,49.59 82.55,49.58 82.55,48.43 82.56,48.43
  pour Top (rank 3): 69.66,48.03 69.37,48.03 69.08,48.03 68.81,48.03 68.49,48.04 68.49,47.15 68.49,47.14 68.76,47.06 69.05,46.98 69.35,46.91 69.66,46.84 69.66,46.85
  pour Top (rank 3): 86.07,44.86 87.23,44.86 87.24,44.86 87.24,45.98 87.2,45.98 87,46 86.68,46.02 86.37,46.03 86.07,46.04
  pour Top (rank 3): 91.84,44.86 91.63,44.93 91.43,45.01 91.23,45.09 90.93,45.22 90.76,45.28 90.75,45.28 90.75,44.86
  pour Top (rank 3): 75.52,44.19 75.33,44.19 75.13,44.2 74.93,44.2 74.73,44.22 74.56,44.23 74.35,44.26 74.35,44.26 74.35,43.52 74.46,43.47 74.58,43.42 74.72,43.37 74.87,43.32 75.02,43.27 75.18,43.22 75.37,43.17 75.52,43.13
  pour Top (rank 3): 89.58,44.86 90.75,44.86 90.75,45.28 90.75,45.29 90.71,45.3 90.53,45.37 90.37,45.41 90.21,45.46 90.05,45.51 89.86,45.56 89.61,45.62 89.59,45.62 89.58,45.62
  pour Top (rank 3): 75.77,43.07 76.69,43.07 76.69,43.08 76.69,44.22 76.69,44.23 76.42,44.21 76.16,44.19 75.85,44.19 75.53,44.19 75.52,44.18 75.52,43.14 75.52,43.13
  pour Top (rank 3): 77.86,43.07 77.86,44.37 77.86,44.38 77.59,44.33 77.32,44.29 77.02,44.26 76.7,44.23 76.69,44.22 76.69,43.07 76.7,43.07
  pour Top (rank 3): 91.93,44.07 92.22,44.03 92.51,43.99 92.79,43.94 93.1,43.89 93.1,44.5 92.78,44.58 92.49,44.65 92.2,44.74 91.93,44.83 91.93,44.82
  pour Top (rank 3): 89.58,44.27 89.87,44.26 90.16,44.24 90.46,44.22 90.75,44.2 90.75,44.85 90.75,44.86 89.59,44.86 89.58,44.85
  pour Top (rank 3): 86.07,44.07 86.34,44.11 86.64,44.16 86.92,44.19 87.24,44.22 87.24,44.85 87.23,44.86 86.07,44.86 86.07,44.85
  pour Top (rank 3): 79.04,43.07 80.21,43.07 80.21,44.85 80.2,44.86 79.59,44.86 79.31,44.75 79.04,44.67 79.04,44.66
  pour Top (rank 3): 80.21,45.1 80.03,45.03 79.77,44.93 79.59,44.86 80.2,44.86 80.21,44.86
  pour Top (rank 3): 84.22,43.56 84.38,43.62 84.55,43.68 84.72,43.74 84.89,43.79 84.9,43.8 84.9,44.85 84.89,44.86 83.73,44.86 83.72,44.85 83.72,43.39 83.98,43.47
  pour Top (rank 3): 90.75,44.86 90.75,44.2 90.76,44.2 91.04,44.17 91.32,44.14 91.59,44.11 91.93,44.07 91.93,44.82 91.92,44.83 91.84,44.85 91.83,44.86
  pour Top (rank 3): 79.04,44.66 78.89,44.62 78.75,44.58 78.46,44.51 78.17,44.44 78.01,44.41 77.86,44.38 77.86,43.08 77.87,43.07 79.03,43.07 79.04,43.07
  pour Top (rank 3): 68.49,45.83 68.17,45.87 67.84,45.92 67.64,45.94 67.43,45.96 67.32,45.97 67.32,45.97 67.32,44.86 68.48,44.86 68.49,44.86
  pour Top (rank 3): 77.86,42.74 77.86,43.06 77.86,43.07 76.7,43.07 76.69,43.06 76.69,42.89 76.7,42.89 76.98,42.84 77.28,42.81 77.58,42.77
  pour Top (rank 3): 94.27,43.66 94.5,43.61 94.71,43.56 94.85,43.49 94.94,43.45 95.03,43.42 95.24,43.34 95.37,43.3 95.44,43.28 95.44,44.19 95.44,44.2 95.12,44.22 94.8,44.24 94.53,44.27 94.28,44.3 94.27,44.3
  pour Top (rank 3): 76.69,43.07 75.78,43.07 75.98,43.02 76.22,42.97 76.45,42.93 76.69,42.89 76.69,42.9
  pour Top (rank 3): 68.49,44.86 67.32,44.85 67.32,44.24 67.32,44.23 67.64,44.25 67.97,44.27 68.23,44.28 68.48,44.29 68.49,44.29
  pour Top (rank 3): 69.66,45.6 69.38,45.67 69.09,45.72 68.77,45.78 68.49,45.83 68.49,44.86 68.5,44.86 69.66,44.86
  pour Top (rank 3): 87.24,44.22 87.53,44.25 87.81,44.26 88.1,44.28 88.41,44.29 88.41,44.29 88.41,44.85 88.41,44.86 87.25,44.86 87.24,44.85
  pour Top (rank 3): 93.1,44.5 93.1,43.89 93.45,43.82 93.72,43.77 93.99,43.72 94.27,43.66 94.27,43.67 94.27,44.3 94.26,44.3 93.94,44.35 93.61,44.4 93.27,44.46
  pour Top (rank 3): 79.04,42.68 79.04,43.07 77.87,43.07 77.86,43.07 77.86,42.75 77.92,42.74 78.12,42.72 78.44,42.7 78.74,42.69
  pour Top (rank 3): 87.24,44.86 88.41,44.86 88.41,45.84 88.41,45.84 88.08,45.89 87.75,45.93 87.54,45.95 87.32,45.97 87.24,45.98 87.24,45.97
  pour Top (rank 3): 71.05,45.16 70.89,45.22 70.84,45.24 70.83,45.24 70.83,44.86 70.84,44.86 71.81,44.86 71.81,44.86 71.6,44.93 71.4,45.01 71.22,45.08
  pour Top (rank 3): 72,44.79 71.81,44.86 70.84,44.86 70.83,44.85 70.83,44.19 70.84,44.19 71.17,44.16 71.49,44.12 72,44.06
  pour Top (rank 3): 82.55,44.86 82.55,45.76 82.54,45.76 82.35,45.72 82.17,45.69 81.99,45.65 81.69,45.58 81.38,45.49 81.38,45.48 81.38,44.86
  pour Top (rank 3): 81.38,44.86 81.38,45.48 81.38,45.49 81.06,45.4 80.76,45.3 80.59,45.25 80.43,45.19 80.23,45.11 80.22,45.11 80.21,45.1 80.21,44.86
  pour Top (rank 3): 82.62,43.07 82.9,43.14 83.18,43.22 83.45,43.3 83.72,43.38 83.72,43.39 83.72,44.86 82.56,44.86 82.55,44.85 82.55,43.07 82.56,43.07
  pour Top (rank 3): 81.38,43.07 82.55,43.07 82.55,44.85 82.55,44.86 81.38,44.86 81.38,44.85
  pour Top (rank 3): 81.38,44.86 80.21,44.85 80.21,43.07 80.21,43.07 81.37,43.07 81.38,43.08
  pour Top (rank 3): 69.66,44.27 69.66,44.86 68.5,44.86 68.49,44.85 68.49,44.29 68.5,44.29 68.84,44.29 69.1,44.29 69.37,44.28
  pour Top (rank 3): 74.26,43.56 74.35,43.52 74.35,43.53 74.35,44.26 74.34,44.26 74.05,44.31 73.75,44.36 73.46,44.41 73.18,44.47 73.18,44.47 73.18,43.88 73.18,43.87 73.54,43.8 73.86,43.74 73.95,43.71 74.07,43.66 74.17,43.61
  pour Top (rank 3): 80.21,42.71 80.21,43.06 80.2,43.07 79.04,43.07 79.04,43.06 79.04,42.69 79.04,42.68 79.27,42.68 79.6,42.69 79.91,42.7
  pour Top (rank 3): 88.41,44.86 89.58,44.86 89.58,45.62 89.57,45.63 89.39,45.67 89.05,45.74 88.74,45.79 88.41,45.84 88.41,45.84
  pour Top (rank 3): 82.55,44.86 83.72,44.86 83.72,45.93 83.72,45.94 83.61,45.92 83.39,45.9 83.17,45.87 82.98,45.84 82.79,45.81 82.56,45.77 82.55,45.76
  pour Top (rank 3): 67.32,44.86 66.15,44.86 66.15,44.85 66.15,44.1 66.15,44.09 66.43,44.13 66.72,44.17 67,44.2 67.31,44.23 67.32,44.24
  pour Top (rank 3): 88.41,44.29 88.69,44.29 88.99,44.29 89.27,44.28 89.58,44.27 89.58,44.85 89.58,44.86 88.42,44.86 88.41,44.85
  pour Top (rank 3): 70.83,44.86 69.67,44.86 69.66,44.85 69.66,44.28 69.66,44.27 69.95,44.25 70.24,44.24 70.54,44.21 70.83,44.19 70.83,44.19
  pour Top (rank 3): 66.15,46.04 65.85,46.04 65.55,46.04 65.25,46.04 64.97,46.03 64.97,44.86 64.98,44.86 66.14,44.86 66.15,44.86
  pour Top (rank 3): 73.18,44.47 72.88,44.54 72.58,44.62 72.29,44.7 72,44.79 72,44.06 72.35,44.01 72.61,43.97 72.9,43.92 73.17,43.87 73.18,43.88
  pour Top (rank 3): 66.15,44.86 64.98,44.86 64.97,44.85 64.97,43.83 64.98,43.83 65.12,43.87 65.28,43.91 65.57,43.98 65.84,44.03 66.15,44.09
  pour Top (rank 3): 70.83,45.25 70.7,45.3 70.57,45.34 70.43,45.39 70.28,45.44 70.11,45.48 69.94,45.53 69.7,45.59 69.67,45.6 69.66,45.6 69.66,44.86 69.66,44.86 70.83,44.86 70.83,44.86
  pour Top (rank 3): 67.32,45.97 67.03,45.99 66.73,46.01 66.44,46.03 66.15,46.04 66.15,44.86 66.15,44.86 67.31,44.86 67.32,44.86
  pour Top (rank 3): 82.55,43.05 82.55,43.06 82.55,43.07 81.39,43.07 81.38,43.07 81.38,42.83 81.67,42.88 81.97,42.93 82.26,42.99
  pour Top (rank 3): 84.9,44.86 84.9,46.02 84.89,46.03 84.58,46.01 84.27,45.99 83.94,45.96 83.73,45.94 83.72,45.94 83.72,44.86 83.73,44.86
  pour Top (rank 3): 81.38,42.83 81.38,43.07 81.37,43.07 80.21,43.07 80.21,43.06 80.21,42.72 80.21,42.71 80.51,42.73 80.81,42.76 81.09,42.79
  pour Top (rank 3): 84.9,43.8 85.17,43.87 85.46,43.95 85.74,44.01 86.07,44.07 86.07,44.85 86.06,44.86 84.9,44.86 84.9,44.85
  pour Top (rank 3): 82.62,43.07 82.56,43.07 82.55,43.06 82.55,43.05 82.56,43.05
  pour Top (rank 3): 86.07,44.86 86.07,46.04 86.04,46.04 85.82,46.04 85.5,46.04 85.19,46.04 84.9,46.03 84.9,46.02 84.9,44.86
  pour Top (rank 3): 74.35,32.35 73.18,32.35 73.18,31.52 73.31,31.48 73.44,31.43 73.58,31.39 73.73,31.35 73.87,31.31 74.04,31.27 74.35,31.2
  pour Top (rank 3): 77.86,30.85 77.86,32.35 77.86,32.35 76.69,32.35 76.69,32.34 76.69,30.88 76.98,30.87 77.28,30.86 77.57,30.85
  pour Top (rank 3): 67.32,32.46 67.32,33.92 67.31,33.93 67.02,33.98 66.71,34.02 66.35,34.07 66.15,34.1 66.15,34.1 66.15,32.43 66.46,32.45 66.74,32.45 67.03,32.46
  pour Top (rank 3): 83.72,32.08 84,32.15 84.29,32.21 84.58,32.26 84.89,32.31 84.9,32.31 84.89,32.35 83.73,32.35 83.72,32.35
  pour Top (rank 3): 83.72,32.35 84.9,32.35 84.9,34.13 84.89,34.14 83.73,34.14 83.72,34.13
  pour Top (rank 3): 82.55,32.35 83.72,32.35 83.72,34.13 83.72,34.14 82.56,34.14 82.55,34.13
  pour Top (rank 3): 82.55,31.71 82.84,31.82 82.98,31.87 83.13,31.91 83.27,31.96 83.42,32 83.57,32.04 83.72,32.08 83.72,32.09 83.72,32.35 83.72,32.35 82.55,32.35
  pour Top (rank 3): 74.35,32.36 74.06,32.35 73.77,32.36 73.48,32.37 73.18,32.38 73.18,32.37 73.18,32.35 73.18,32.35 74.35,32.35
  pour Top (rank 3): 77.86,32.98 77.72,32.93 77.58,32.88 77.44,32.84 77.3,32.79 77.14,32.75 77,32.71 76.84,32.67 76.7,32.64 76.69,32.63 76.69,32.35 76.7,32.35 77.86,32.35 77.86,32.36
  pour Top (rank 3): 89.58,32.33 89.58,32.35 89.57,32.35 89.35,32.35
  pour Top (rank 3): 69.66,32.35 69.66,33.24 69.33,33.38 69.22,33.42 69.1,33.47 68.96,33.52 68.81,33.57 68.65,33.61 68.49,33.66 68.49,32.42 68.49,32.42 68.91,32.39 69.32,32.35
  pour Top (rank 3): 80.21,32.35 79.04,32.35 79.04,32.35 79.04,30.92 79.04,30.92 79.26,30.94 79.6,30.98 79.9,31.02 80.21,31.07
  pour Top (rank 3): 82.55,34.14 83.71,34.14 83.72,34.14 83.72,34.2 83.72,34.21 83.61,34.21 83.34,34.2 83.07,34.19 82.82,34.17 82.56,34.15 82.55,34.15
  pour Top (rank 3): 84.9,34.14 84.9,32.35 84.9,32.35 85.22,32.35 85.46,32.38 85.65,32.39 85.86,32.41 86.06,32.42 86.07,32.43 86.07,34.11 85.99,34.12 85.78,34.14
  pour Top (rank 3): 80.21,33.77 79.91,33.7 79.61,33.61 79.32,33.53 79.04,33.43 79.04,33.43 79.04,32.36 79.04,32.35 80.2,32.35 80.21,32.35
  pour Top (rank 3): 88.41,33.69 88.41,32.43 88.42,32.42 88.65,32.41 88.88,32.39 89.35,32.35 89.58,32.35 89.58,32.35 89.58,33.27 89.58,33.28 89.29,33.4 89.16,33.45 89.03,33.5 88.89,33.55 88.74,33.59 88.58,33.64
  pour Top (rank 3): 82.55,34.14 82.55,34.15 82.54,34.15 82.41,34.14
  pour Top (rank 3): 75.52,32.35 74.36,32.35 74.35,32.35 74.35,31.21 74.35,31.2 74.63,31.14 74.93,31.09 75.22,31.04 75.52,31
  pour Top (rank 3): 94.27,32.35 94.27,31.33 94.28,31.32 94.51,31.26 94.68,31.22 94.86,31.18 95.06,31.14 95.26,31.11 95.44,31.07 95.44,31.08 95.44,32.35 95.43,32.35
  pour Top (rank 3): 75.52,32.44 75.28,32.41 75.02,32.39 74.69,32.37 74.52,32.36 74.35,32.36 74.35,32.35 75.51,32.35 75.52,32.35
  pour Top (rank 3): 76.69,32.35 75.53,32.35 75.52,32.35 75.52,31 75.82,30.96 76.1,30.93 76.39,30.9 76.69,30.88 76.69,30.89
  pour Top (rank 3): 81.38,34.01 81.38,32.35 81.39,32.35 82.55,32.35 82.55,34.13 82.55,34.14 82.42,34.14 82.19,34.11 81.99,34.09 81.78,34.07 81.58,34.04
  pour Top (rank 3): 93.1,31.73 93.11,31.73 93.18,31.7 93.24,31.66 93.35,31.62 93.48,31.57 93.63,31.51 93.8,31.46 93.99,31.4 94.26,31.32 94.27,31.33 94.27,32.35 93.1,32.35
  pour Top (rank 3): 73.18,32.38 73.12,32.39 72.96,32.4 72.63,32.45 72.32,32.5 72,32.56 72,32.35 72.01,32.35 73.17,32.35 73.18,32.35
  pour Top (rank 3): 94.27,32.36 94.27,32.35 95.44,32.35 95.44,32.36 95.44,32.39 95.43,32.39 95.12,32.37 94.85,32.36 94.56,32.36
  pour Top (rank 3): 72,32.35 70.84,32.35 70.83,32.35 70.83,32.17 70.84,32.16 71.15,32.11 71.47,32.06 71.74,32.01 72,31.96 72,31.97
  pour Top (rank 3): 90.75,32.86 90.75,32.35 91.93,32.35 91.93,32.57 91.92,32.58 91.66,32.63 91.41,32.69 91.08,32.77
  pour Top (rank 3): 81.38,31.33 81.68,31.41 81.97,31.51 82.27,31.61 82.55,31.71 82.55,31.72 82.55,32.34 82.55,32.35 81.38,32.35 81.38,32.34
  pour Top (rank 3): 90.75,32.18 91.04,32.14 91.33,32.09 91.63,32.04 91.92,31.98 91.93,31.99 91.93,32.35 90.75,32.35
  pour Top (rank 3): 72.66,31.73 72.79,31.67 72.93,31.61 73.05,31.56 73.17,31.52 73.18,31.53 73.18,32.35 73.17,32.35 72.01,32.35 72,31.97 72.01,31.96 72.27,31.91 72.38,31.86 72.48,31.82 72.57,31.78
  pour Top (rank 3): 93.1,32.35 94.27,32.35 94.27,32.36 93.93,32.37 93.6,32.38 93.34,32.4 93.1,32.42
  pour Top (rank 3): 87.24,32.46 87.53,32.46 87.81,32.45 88.11,32.44 88.41,32.42 88.41,33.68 88.41,33.69 88.1,33.77 87.78,33.84 87.57,33.88 87.36,33.92 87.24,33.94 87.24,33.94
  pour Top (rank 3): 80.21,32.35 81.38,32.35 81.38,34 81.37,34.01 81.16,33.97 80.96,33.94 80.76,33.9 80.56,33.85 80.36,33.81 80.21,33.78 80.21,33.77
  pour Top (rank 3): 72,32.56 71.71,32.61 71.42,32.68 71.15,32.75 70.83,32.83 70.83,32.35 72,32.35 72,32.35
  pour Top (rank 3): 85.78,34.14 85.53,34.16 85.3,34.17 85.02,34.19 84.9,34.2 84.9,34.19 84.9,34.14 84.9,34.14
  pour Top (rank 3): 70.83,32.35 69.67,32.35 69.66,32.35 69.66,32.33 69.66,32.32 69.95,32.28 70.23,32.25 70.52,32.21 70.83,32.16 70.83,32.17
  pour Top (rank 3): 80.21,31.07 80.5,31.12 80.79,31.19 81.08,31.25 81.37,31.33 81.38,31.33 81.38,32.35 81.37,32.35 80.21,32.35
  pour Top (rank 3): 85.23,32.35 84.9,32.35 84.9,32.34 84.9,32.31 84.9,32.31
  pour Top (rank 3): 79.04,32.35 77.86,32.35 77.86,30.86 77.87,30.85 78.07,30.86 78.43,30.87 78.73,30.89 79.03,30.91 79.04,30.92
  pour Top (rank 3): 64.97,34.19 64.97,34.14 65.75,34.14 65.37,34.17
  pour Top (rank 3): 76.69,32.64 76.41,32.58 76.12,32.52 75.82,32.48 75.52,32.44 75.52,32.43 75.52,32.36 75.53,32.35 76.69,32.35 76.69,32.36
  pour Top (rank 3): 79.04,33.43 78.83,33.36 78.64,33.28 78.46,33.21 78.15,33.09 77.86,32.98 77.86,32.36 77.87,32.35 79.03,32.35 79.04,32.35
  pour Top (rank 3): 64.97,32.35 64.97,32.33 64.98,32.32 65.2,32.35
  pour Top (rank 3): 66.15,32.43 66.15,34.09 66.14,34.1 66.07,34.11 65.76,34.14 64.98,34.14 64.97,34.13 64.97,32.36 64.98,32.35 65.21,32.35 65.43,32.38 65.67,32.4 65.91,32.42
  pour Top (rank 3): 89.58,32.33 89.85,32.3 90.11,32.27 90.44,32.22 90.75,32.18 90.75,32.18 90.75,32.35 89.59,32.35 89.58,32.35
  pour Top (rank 3): 89.58,32.35 90.75,32.35 90.75,32.86 90.46,32.95 90.17,33.05 89.9,33.15 89.74,33.21 89.59,33.28 89.58,33.28
  pour Top (rank 3): 83.72,34.21 83.72,34.15 83.73,34.14 84.89,34.14 84.9,34.14 84.9,34.19 84.89,34.2 84.59,34.21 84.3,34.21 84.01,34.21
  pour Top (rank 3): 91.93,31.98 92.23,31.92 92.53,31.86 92.82,31.79 93.09,31.73 93.1,31.74 93.1,32.35 93.09,32.35 91.93,32.35 91.93,32.34
  pour Top (rank 3): 91.93,32.35 93.09,32.35 93.1,32.35 93.1,32.42 93.09,32.42 92.76,32.46 92.44,32.5 92.18,32.54 91.93,32.58 91.93,32.57
  pour Top (rank 3): 69.33,32.35 69.66,32.32 69.66,32.32 69.66,32.34 69.66,32.35
  pour Top (rank 3): 70.83,32.83 70.53,32.92 70.37,32.97 70.22,33.02 69.94,33.12 69.8,33.18 69.66,33.23 69.66,33.23 69.66,32.35 69.67,32.35 70.83,32.35
  pour Top (rank 3): 86.07,32.43 86.34,32.44 86.63,32.45 86.9,32.46 87.24,32.46 87.24,33.94 87.23,33.95 87.06,33.98 86.7,34.03 86.39,34.07 86.07,34.11 86.07,34.1
  pour Top (rank 3): 68.49,33.66 68.2,33.74 67.9,33.81 67.72,33.85 67.53,33.89 67.32,33.93 67.32,33.92 67.32,32.46 67.32,32.46 67.65,32.45 67.97,32.44 68.23,32.43 68.49,32.42 68.49,32.42
  pour Top (rank 3): 67.32,28.78 66.15,28.78 66.15,28.78 66.15,27.16 66.44,27.21 66.74,27.27 67.06,27.33 67.25,27.37 67.32,27.39
  pour Top (rank 3): 84.9,27.03 85.18,27.05 85.48,27.08 85.77,27.11 86.06,27.15 86.07,27.16 86.07,28.77 86.07,28.78 84.9,28.78 84.9,28.77
  pour Top (rank 3): 67.32,30.1 66.99,30.03 66.68,29.97 66.5,29.92 66.33,29.88 66.15,29.83 66.15,29.83 66.15,28.78 66.15,28.78 67.31,28.78 67.32,28.79
  pour Top (rank 3): 84.9,28.78 86.06,28.78 86.07,28.78 86.07,29.8 85.75,29.71 85.46,29.61 85.15,29.51 84.99,29.45 84.9,29.41
  pour Top (rank 3): 66.15,29.83 65.85,29.75 65.55,29.65 65.26,29.55 64.98,29.45 64.97,29.44 64.97,28.78 64.98,28.78 66.14,28.78 66.15,28.79
  pour Top (rank 3): 86.07,28.78 87.23,28.78 87.24,28.78 87.24,30.08 86.92,30.02 86.62,29.95 86.3,29.87 86.1,29.81 86.08,29.81 86.07,29.8
  pour Top (rank 3): 80.21,28.51 80.02,28.51 79.83,28.52 79.65,28.53 79.46,28.54 79.26,28.56 79.04,28.59 79.04,28.58 79.04,27.87 79.13,27.82 79.25,27.77 79.38,27.72 79.53,27.67 79.69,27.61 79.86,27.56 80.03,27.51 80.2,27.47 80.21,27.47
  pour Top (rank 3): 83.72,27.01 84.02,27.01 84.32,27.01 84.63,27.02 84.9,27.03 84.9,28.77 84.89,28.78 83.73,28.78 83.72,28.77
  pour Top (rank 3): 77.86,28.78 76.69,28.78 76.69,28.39 76.69,28.39 76.99,28.34 77.28,28.3 77.56,28.26 77.86,28.2 77.86,28.21
  pour Top (rank 3): 77.86,28.81 77.55,28.88 77.25,28.96 76.97,29.04 76.69,29.13 76.69,28.78 76.7,28.78 77.86,28.78
  pour Top (rank 3): 88.41,27.69 88.71,27.8 89.05,27.93 89.2,27.98 89.38,28.04 89.58,28.1 89.58,28.11 89.58,28.77 89.58,28.78 88.41,28.78 88.41,28.77
  pour Top (rank 3): 82.55,28.69 82.55,27.07 82.85,27.05 83.16,27.03 83.49,27.02 83.71,27.01 83.72,27.01 83.72,28.77 83.72,28.78 82.97,28.78 82.76,28.73
  pour Top (rank 3): 88.41,28.78 89.57,28.78 89.58,28.78 89.58,30.35 89.57,30.35 89.35,30.34 89.02,30.31 88.72,30.29 88.41,30.26 88.41,30.25
  pour Top (rank 3): 81.38,27.22 81.67,27.18 81.98,27.13 82.32,27.09 82.54,27.07 82.55,27.07 82.55,28.69 82.28,28.65 82,28.61 81.74,28.58 81.56,28.56 81.39,28.55 81.38,28.54
  pour Top (rank 3): 80.21,28.51 80.21,27.48 80.21,27.47 80.49,27.4 80.78,27.33 81.07,27.27 81.38,27.22 81.38,28.54 81.06,28.53 80.78,28.51 80.5,28.51
  pour Top (rank 3): 70.83,30.36 70.52,30.37 70.22,30.37 69.9,30.36 69.69,30.35 69.66,30.35 69.66,28.78 69.67,28.78 70.83,28.78 70.83,28.78
  pour Top (rank 3): 70.83,28.78 69.67,28.78 69.66,28.78 69.66,28.14 69.96,28.22 70.23,28.28 70.5,28.34 70.66,28.37 70.82,28.4 70.83,28.4
  pour Top (rank 3): 69.66,30.35 69.37,30.34 69.07,30.32 68.78,30.3 68.49,30.27 68.49,28.78 68.49,28.78 69.66,28.78 69.66,28.78
  pour Top (rank 3): 90.75,28.78 91.92,28.78 91.93,28.78 91.93,30.3 91.92,30.31 91.75,30.32 91.39,30.34 91.07,30.36 90.76,30.36 90.75,30.36
  pour Top (rank 3): 66.15,28.78 64.98,28.78 64.97,28.78 64.97,27.05 64.98,27.04 65.28,27.06 65.57,27.09 65.89,27.13 66.08,27.16 66.15,27.17
  pour Top (rank 3): 69.66,28.14 69.66,28.77 69.65,28.78 68.49,28.78 68.49,28.77 68.49,27.74 68.49,27.73 68.72,27.81 69.03,27.93 69.2,27.99 69.43,28.06
  pour Top (rank 3): 93.1,28.78 94.27,28.78 94.27,29.96 93.98,30.02 93.67,30.08 93.33,30.14 93.11,30.17 93.1,30.17
  pour Top (rank 3): 86.07,27.15 86.37,27.2 86.69,27.25 87.01,27.31 87.23,27.36 87.24,27.37 87.24,28.77 87.23,28.78 86.07,28.78 86.07,28.77
  pour Top (rank 3): 87.24,27.36 87.54,27.44 87.83,27.51 88.12,27.6 88.41,27.69 88.41,27.7 88.41,28.77 88.41,28.78 87.25,28.78 87.24,28.77
  pour Top (rank 3): 93.1,28.61 93.39,28.61 93.68,28.61 93.96,28.61 94.26,28.6 94.27,28.6 94.27,28.77 94.26,28.78 93.1,28.78 93.1,28.77
  pour Top (rank 3): 87.24,28.78 88.41,28.78 88.41,30.25 88.41,30.26 88.1,30.22 87.81,30.18 87.49,30.12 87.24,30.08
  pour Top (rank 3): 74.35,29.94 74.06,30 73.76,30.06 73.43,30.12 73.21,30.16 73.18,30.16 73.18,28.78 73.18,28.78 74.34,28.78 74.35,28.78
  pour Top (rank 3): 89.58,28.1 89.73,28.15 89.87,28.19 90.16,28.26 90.45,28.33 90.75,28.38 90.75,28.78 89.59,28.78 89.58,28.78
  pour Top (rank 3): 68.49,30.27 68.18,30.23 67.89,30.19 67.59,30.15 67.32,30.1 67.32,28.78 67.32,28.78 68.48,28.78 68.49,28.78
  pour Top (rank 3): 91.93,28.78 93.09,28.78 93.1,28.78 93.1,30.18 92.78,30.22 92.45,30.26 92.25,30.28 92.04,30.3 91.93,30.31 91.93,30.3
  pour Top (rank 3): 72,30.3 71.72,30.32 71.42,30.34 71.13,30.35 70.83,30.36 70.83,28.78 70.84,28.78 72,28.78 72,28.78
  pour Top (rank 3): 91.93,28.54 92.21,28.57 92.5,28.58 92.79,28.6 93.1,28.61 93.1,28.62 93.1,28.78 91.93,28.78
  pour Top (rank 3): 72,28.78 70.84,28.78 70.83,28.78 70.83,28.4 71.12,28.45 71.39,28.49 71.66,28.52 72,28.55 72,28.55
  pour Top (rank 3): 73.18,28.78 72,28.78 72,28.55 72.01,28.55 72.34,28.58 72.6,28.59 72.89,28.6 73.17,28.61 73.18,28.62
  pour Top (rank 3): 76.69,28.78 75.53,28.78 75.52,28.77 75.52,28.52 75.81,28.49 76.1,28.46 76.39,28.42 76.69,28.39 76.69,28.39
  pour Top (rank 3): 75.52,28.78 74.36,28.78 74.35,28.77 74.35,28.6 74.35,28.6 74.63,28.58 74.93,28.56 75.23,28.54 75.51,28.52 75.52,28.52
  pour Top (rank 3): 73.18,30.16 72.86,30.21 72.55,30.24 72.17,30.28 72.01,30.3 72,30.3 72,28.78 72.01,28.78 73.17,28.78 73.18,28.79
  pour Top (rank 3): 68.49,28.78 67.32,28.78 67.32,27.39 67.33,27.39 67.39,27.41 67.59,27.46 67.76,27.5 67.93,27.55 68.11,27.6 68.29,27.66 68.48,27.73 68.49,27.73
  pour Top (rank 3): 75.52,29.59 75.38,29.64 75.24,29.69 75.1,29.73 74.94,29.78 74.77,29.83 74.58,29.88 74.35,29.94 74.35,29.93 74.35,28.78 74.36,28.78 75.52,28.78
  pour Top (rank 3): 76.69,29.13 76.43,29.22 76.18,29.32 75.96,29.4 75.67,29.53 75.52,29.59 75.52,28.78 76.68,28.78 76.69,28.78
  pour Top (rank 3): 83.72,28.97 83.72,28.78 83.73,28.78 84.89,28.78 84.9,28.78 84.9,29.4 84.89,29.41 84.49,29.24 84.23,29.14 83.98,29.05
  pour Top (rank 3): 79,27.89 79.03,27.87 79.04,27.88 79.04,28.59 78.75,28.64 78.51,28.68 78.26,28.73 78.01,28.78 77.87,28.78 77.86,28.77 77.86,28.21 77.87,28.2 78.23,28.14 78.6,28.06 78.69,28.03 78.8,27.98 78.9,27.94
  pour Top (rank 3): 90.75,28.38 91.04,28.43 91.32,28.47 91.62,28.51 91.93,28.54 91.93,28.78 90.76,28.78
  pour Top (rank 3): 74.35,28.6 74.35,28.78 74.34,28.78 73.18,28.78 73.18,28.77 73.18,28.61 73.46,28.61 73.75,28.61 74.05,28.61
  pour Top (rank 3): 89.58,30.35 89.58,28.78 89.59,28.78 90.75,28.78 90.75,28.79 90.75,30.36 90.49,30.37 90.18,30.37 89.88,30.36
  pour Top (rank 3): 77.86,28.81 77.86,28.78 78,28.78
  pour Top (rank 3): 94.27,28.78 94.27,28.61 94.27,28.6 94.53,28.59 94.8,28.57 95.1,28.55 95.43,28.53 95.44,28.53 95.44,28.78 95.43,28.78
  pour Top (rank 3): 83.72,28.78 83.72,28.97 83.72,28.97 83.53,28.92 83.35,28.87 83.17,28.82 82.97,28.78